# Altium schematic sheet Coverpage.SchDoc
size A; SheetNumber: 1; SheetTotal: 1
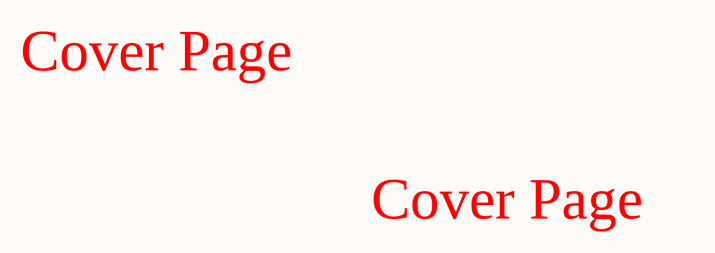
[diagram p0: Coverpage.SchDoc]

## Notes on the sheet
- Cover Page